# Altium schematic sheet Sheet1.SchDoc
size A4; SheetNumber: 1; SheetTotal: 1
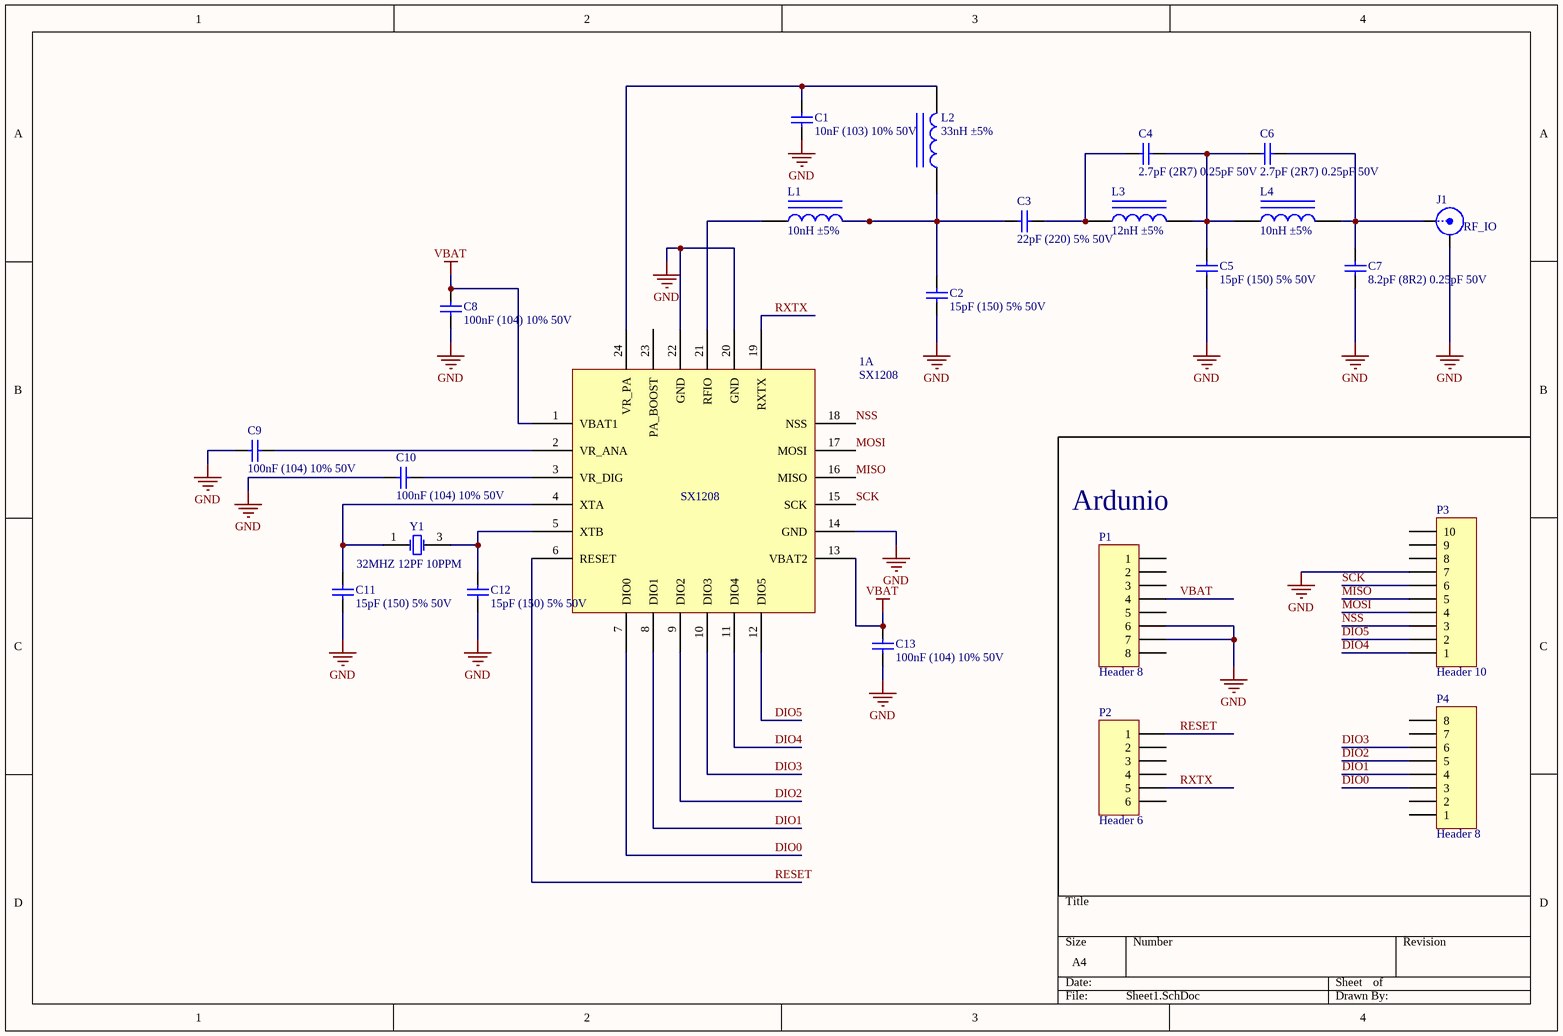
[diagram p0: Sheet1.SchDoc]

## Parts
1  SX1208  [QFN-24_4x4x05P]  (part A of 2)
C1  10nF (103) 10% 50V  [0603_C]
C2  15pF (150) 5% 50V  [0603_C]
C3  22pF (220) 5% 50V  [0603_C]
C4  2.7pF (2R7) 0.25pF 50V  [0603_C]
C5  15pF (150) 5% 50V  [0603_C]
C6  2.7pF (2R7) 0.25pF 50V  [0603_C]
C7  8.2pF (8R2) 0.25pF 50V  [0603_C]
C8  100nF (104) 10% 50V  [0603_C]
C9  100nF (104) 10% 50V  [0603_C]
C10  100nF (104) 10% 50V  [0603_C]
C11  15pF (150) 5% 50V  [0603_C]
C12  15pF (150) 5% 50V  [0603_C]
C13  100nF (104) 10% 50V  [0603_C]
J1  RF_IO  [PCBComponent_1]
L1  10nH ±5%  [0603_L]
L2  33nH ±5%  [0603_L]
L3  12nH ±5%  [0603_L]
L4  10nH ±5%  [0603_L]
P1  Header 8  [HDR1X8]
P2  Header 6  [HDR1X6]
P3  Header 10  [HDR1X10]
P4  Header 8  [HDR1X8]
Y1  32MHZ 12PF 10PPM  [SMD-3225_4P]

## Nets
GND: 1.14(GND) 1.20(GND) 1.22(GND) C1.1 C2.1 C5.1 C7.1 C8.1 C9.2 C10.2 C11.1 C12.1 C13.1 J1.2(Y) P1.6 P1.7 P3.7
VBAT: 1.1(VBAT1) 1.13(VBAT2) C8.2 C13.2 P1.4
DIO0: 1.7(DIO0) P4.3
DIO1: 1.8(DIO1) P4.4
DIO2: 1.9(DIO2) P4.5
DIO3: 1.10(DIO3) P4.6
DIO4: 1.11(DIO4) P3.1
DIO5: 1.12(DIO5) P3.2
MISO: 1.16(MISO) P3.5
MOSI: 1.17(MOSI) P3.4
NSS: 1.18(NSS) P3.3
RESET: 1.6(RESET) P2.1
RXTX: 1.19(RXTX) P2.5
SCK: 1.15(SCK) P3.6
Net1_2: 1.2(VR_ANA) C9.1
Net1_3: 1.3(VR_DIG) C10.1
Net1_4: 1.4(XTA) C11.2 Y1.1(OSC1)
Net1_5: 1.5(XTB) C12.2 Y1.3(OSC2)
Net1_21: 1.21(RFIO) L1.1
Net1_24: 1.24(VR_PA) C1.2 L2.2
NetC2_2: C2.2 C3.1 L1.2 L2.1
NetC3_2: C3.2 C4.1 L3.1
NetC4_2: C4.2 C5.2 C6.1 L3.2 L4.1
NetC6_2: C6.2 C7.2 J1.1(X) L4.2

Not connected (* = marked no-connect by the designer): 1 23(PA_BOOST); P1 1 2 3 5 8; P2 2 3 4 6; P3 8 9 10; P4 1 2 7 8

## Notes on the sheet
- (near P1) Ardunio
- Labels drawn without touching a wire or pin: \

## Library data of the parts
1 = Component_1
C1 = 0603 10nF (103) 10% 50V: 贴片电容; ComponentLink1Description: 供应商链接; ComponentLink1URL: http://www.szlcsc.com/product/details_58143.html; Package: 0603; Supplier: LC; SuppliersPartNumber: C57112
C2 C5 C11 C12 = 0603 15pF (150) 5% 50V: 贴片电容; ComponentLink1Description: 供应商链接; ComponentLink1URL: http://www.szlcsc.com/product/details_1996.html; Package: 0603; Supplier: LC; SuppliersPartNumber: C1644
C3 = 0603 22pF (220) 5% 50V: 贴片电容; ComponentLink1Description: 供应商链接; ComponentLink1URL: http://www.szlcsc.com/product/details_2005.html; Package: 0603; Supplier: LC; SuppliersPartNumber: C1653
C4 C6 = 0603 2.7pF (2R7) 0.25pF 50V: 贴片电容; ComponentLink1Description: 供应商链接; ComponentLink1URL: http://www.szlcsc.com/product/details_16831.html; Package: 0603; Supplier: LC; SuppliersPartNumber: C16149
C7 = 0603 8.2pF (8R2) 0.25pF 50V: 贴片电容; ComponentLink1Description: 供应商链接; ComponentLink1URL: http://www.szlcsc.com/product/details_2037.html; Package: 0603; Supplier: LC; SuppliersPartNumber: C1685
C8-C10 C13 = 0603 100nF (104) 10% 50V: 贴片电容; ComponentLink1Description: 供应商链接; ComponentLink1URL: http://www.szlcsc.com/product/details_15331.html; Package: 0603; Supplier: LC; SuppliersPartNumber: C14663
J1 = SMB: SMB Straight Connector; LatestRevisionDate: 17-Jul-2002; LatestRevisionNote: Re-released for DXP Platform.; Publisher: Altium Limited
L1 L4 = 0603 10nH 5%: 贴片电感; ComponentLink1Description: 供应商链接; ComponentLink1URL: http://www.szlcsc.com/product/details_16347.html; Package: 0603; Supplier: LC; SuppliersPartNumber: C15666
L2 = 0603 33nH 5%: 贴片电感; ComponentLink1Description: 供应商链接; ComponentLink1URL: http://www.szlcsc.com/product/details_36021.html; Package: 0603; Supplier: LC; SuppliersPartNumber: C35050
L3 = 0603 12nH 5%: 贴片电感; ComponentLink1Description: 供应商链接; ComponentLink1URL: http://www.szlcsc.com/product/details_30010.html; Package: 0603; Supplier: LC; SuppliersPartNumber: C29258
P1 P4 = Header 8: Header, 8-Pin; LatestRevisionDate: 17-Jul-2002; LatestRevisionNote: Re-released for DXP Platform.; Publisher: Altium Limited
P2 = Header 6: Header, 6-Pin; LatestRevisionDate: 17-Jul-2002; LatestRevisionNote: Re-released for DXP Platform.; Publisher: Altium Limited
P3 = Header 10: Header, 10-Pin; LatestRevisionDate: 17-Jul-2002; LatestRevisionNote: Re-released for DXP Platform.; Publisher: Altium Limited
Y1 = SMD-3225_4P  25MHZ 12PF 10PPM: 贴片晶振; ComponentLink1Description: 供应商链接; ComponentLink1URL: http://www.szlcsc.com/product/details_9526.html; Package: SMD-3225_4P; Supplier: LC; SuppliersPartNumber: C9006